# EAGLE schematic front-panel-revD-DEB-board2 (EAGLE 5.11)
DRAWN_BY: Alexios; PROJECT_NAME: CFT Mini-Computer; REVISION: Rev D; SHEET_DESCRIPTION: Output shift registers; SIMULATION_FILENAME: To be coded; URL: http://www.bedroomlan.org/cft

## Sheet 1 of 5
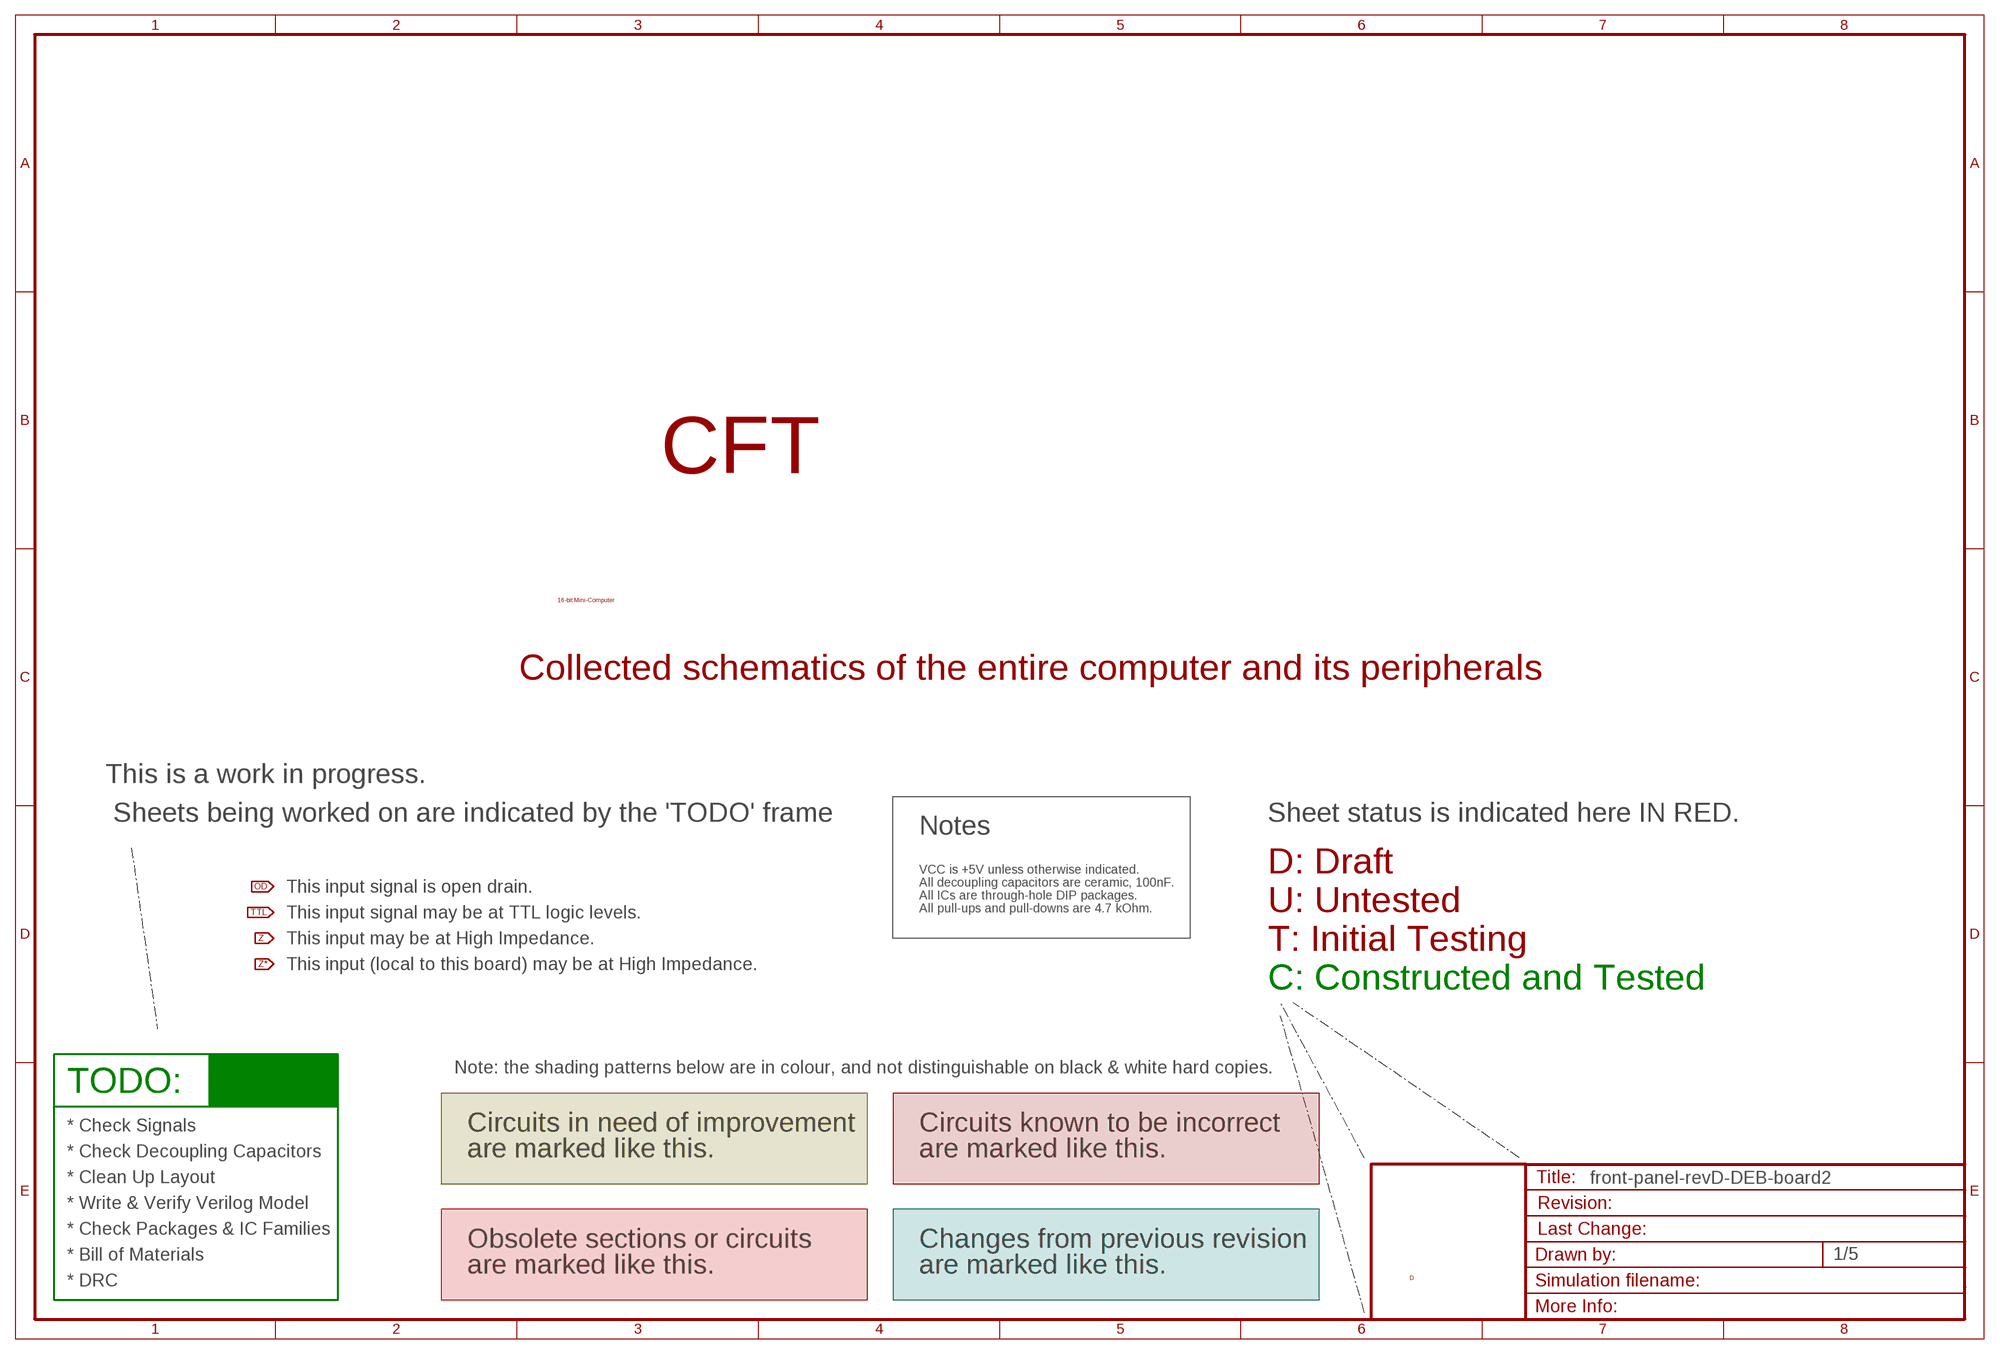
[diagram p0: schematic, sheet 1]

### Notes on the sheet
- CFT
- 16-bit Mini-Computer
- Collected schematics of the entire computer and its peripherals
- This is a work in progress.
- Sheets being worked on are indicated by the 'TODO' frame | Sheet status is indicated here IN RED.
- Notes
- VCC is +5V unless otherwise indicated. | D: Draft
- All decoupling capacitors are ceramic, 100nF.
- This input signal is open drain.
- All ICs are through-hole DIP packages.
- All pull-ups and pull-downs are 4.7 kOhm. | U: Untested
- This input signal may be at TTL logic levels.
- This input may be at High Impedance.
- T: Initial Testing
- This input (local to this board) may be at High Impedance.
- C: Constructed and Tested
- Note: the shading patterns below are in colour, and not distinguishable on black & white hard copies.
- TODO:
- * Check Signals | Circuits in need of improvement | Circuits known to be incorrect
- * Check Decoupling Capacitors | are marked like this. | are marked like this.
- * Clean Up Layout
- * Write & Verify Verilog Model
- * Check Packages & IC Families
- Obsolete sections or circuits | Changes from previous revision
- * Bill of Materials
- are marked like this. | are marked like this.
- D
- * DRC

## Sheet 2 of 5
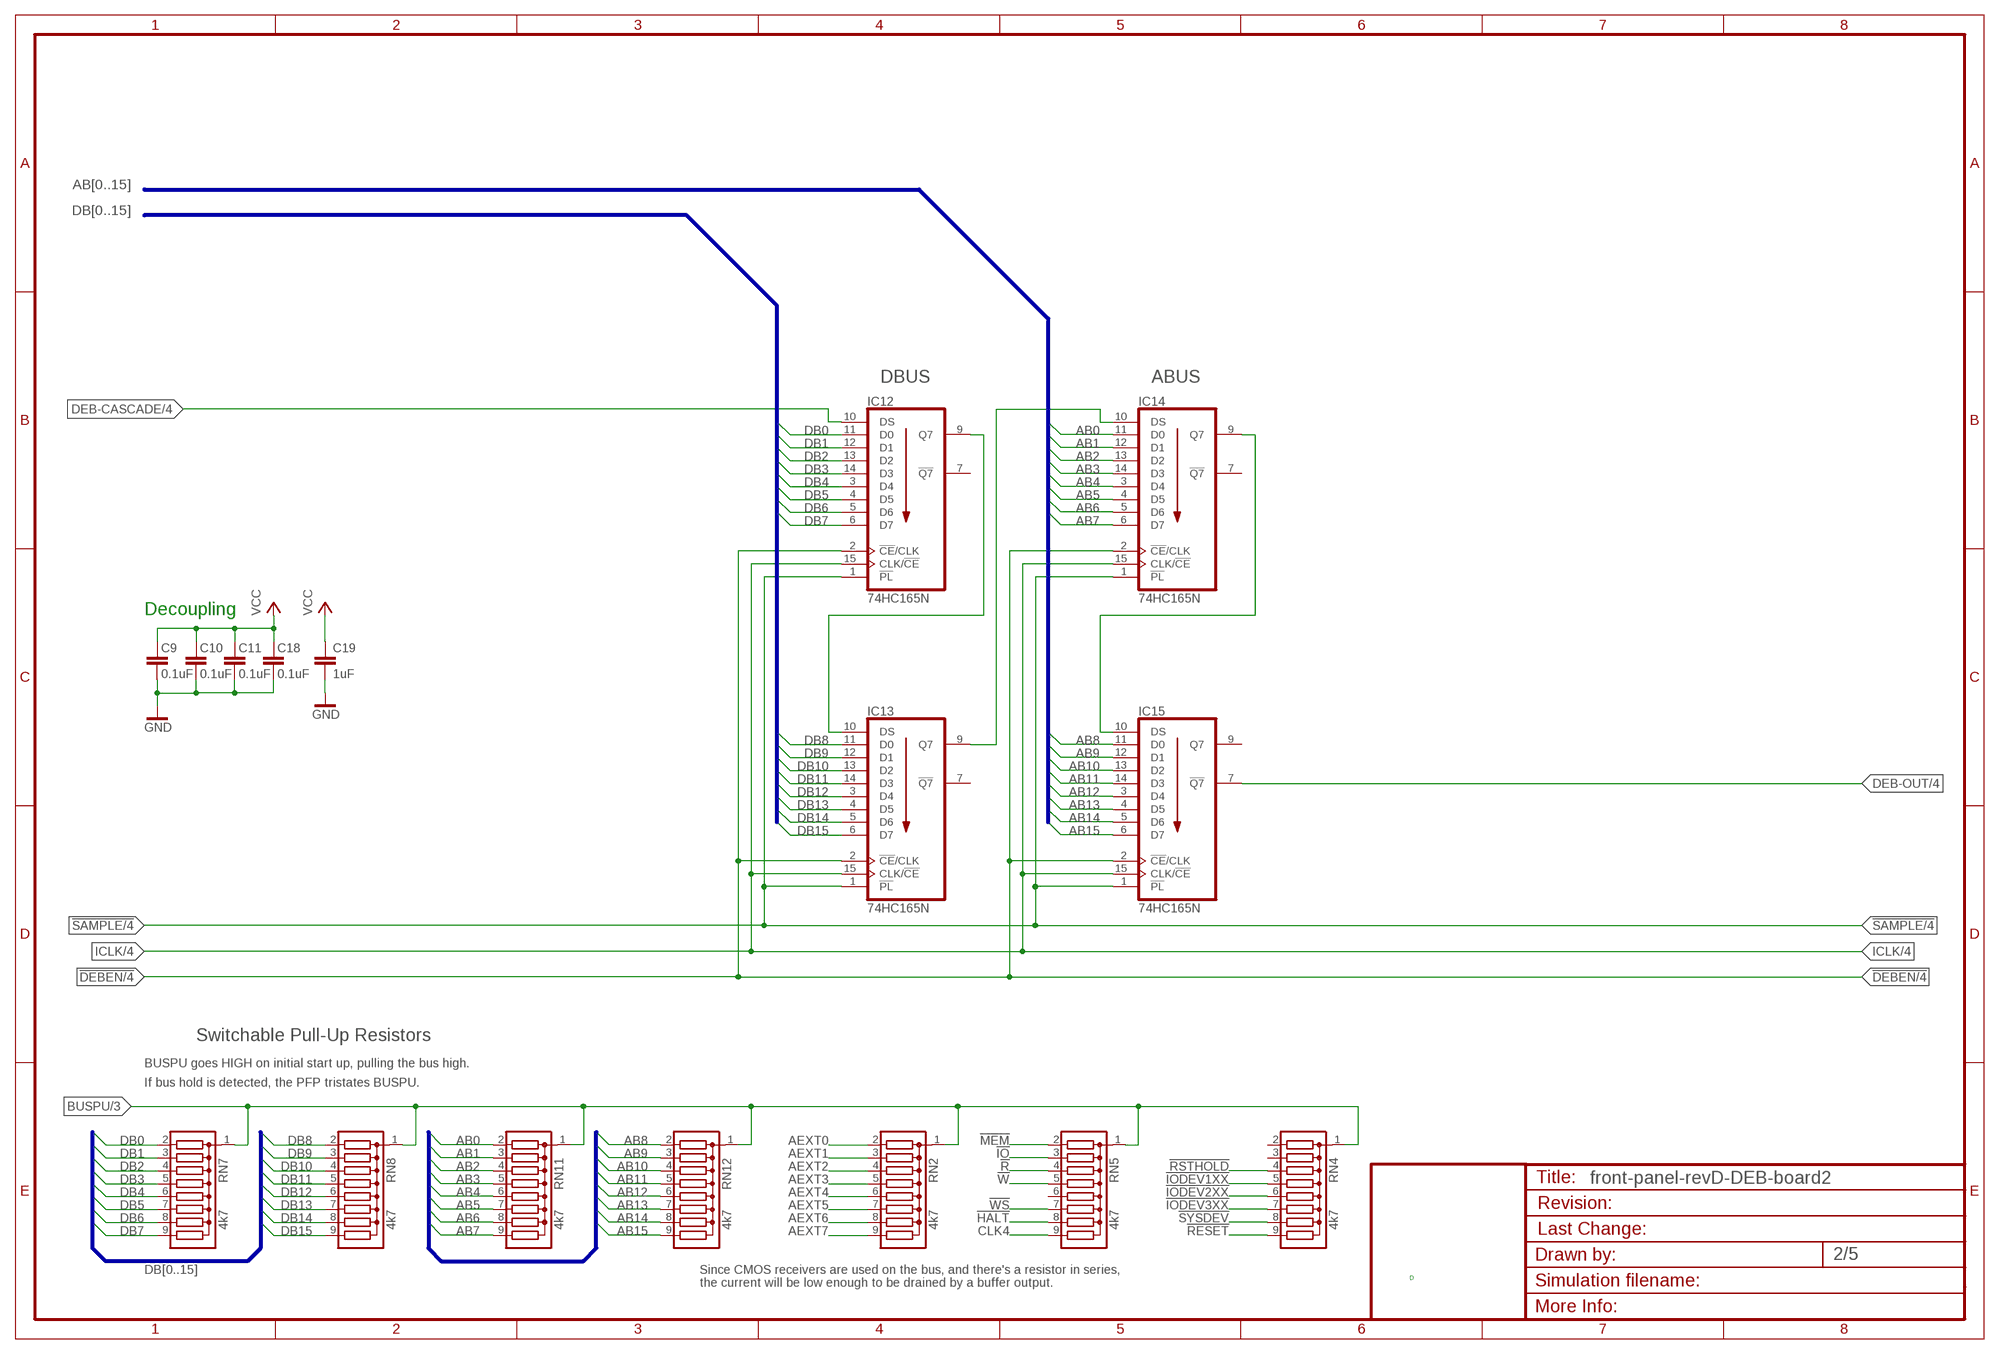
[diagram p1: schematic, sheet 2]

### Parts
C9  0.1uF  C-EU025-024X044  [C025-024X044]
C10  0.1uF  C-EU025-024X044  [C025-024X044]
C11  0.1uF  C-EU025-024X044  [C025-024X044]
C18  0.1uF  C-EU025-024X044  [C025-024X044]
C19  1uF  C-EU025-024X044  [C025-024X044]
IC12  74HC165N  [DIL16]
IC13  74HC165N  [DIL16]
IC14  74HC165N  [DIL16]
IC15  74HC165N  [DIL16]
RN2  4k7  G08R  [SIL9]
RN4  4k7  G08R  [SIL9]
RN5  4k7  G08R  [SIL9]
RN7  4k7  G08R  [SIL9]
RN8  4k7  G08R  [SIL9]
RN11  4k7  G08R  [SIL9]
RN12  4k7  G08R  [SIL9]

### Nets
!DEBEN: IC12.2(!CE!/CLK) IC13.2(!CE!/CLK) IC14.2(!CE!/CLK) IC15.2(!CE!/CLK) ; also sheet 4
!HALT: RN5.8 ; also sheet 5
!IO: RN5.3 ; also sheet 5
!IODEV1XX: RN4.5 ; also sheet 5
!IODEV2XX: RN4.6 ; also sheet 5
!IODEV3XX: RN4.7 ; also sheet 5
!MEM: RN5.2 ; also sheet 5
!R: RN5.4 ; also sheet 3,5
!RESET: RN4.9 ; also sheet 5
!RSTHOLD: RN4.4 ; also sheet 5
!SAMPLE: IC12.1(!PL) IC13.1(!PL) IC14.1(!PL) IC15.1(!PL) ; also sheet 4
!SYSDEV: RN4.8 ; also sheet 5
!W: RN5.5 ; also sheet 5
!WS: RN5.7 ; also sheet 4,5
AB0: IC14.11(D0) RN11.2 ; also sheet 3,5
AB1: IC14.12(D1) RN11.3 ; also sheet 3,5
AB2: IC14.13(D2) RN11.4 ; also sheet 3,5
AB3: IC14.14(D3) RN11.5 ; also sheet 3,5
AB4: IC14.3(D4) RN11.6 ; also sheet 3,5
AB5: IC14.4(D5) RN11.7 ; also sheet 3,5
AB6: IC14.5(D6) RN11.8 ; also sheet 3,5
AB7: IC14.6(D7) RN11.9 ; also sheet 3,5
AB8: IC15.11(D0) RN12.2 ; also sheet 3,5
AB9: IC15.12(D1) RN12.3 ; also sheet 3,5
AB10: IC15.13(D2) RN12.4 ; also sheet 3,5
AB11: IC15.14(D3) RN12.5 ; also sheet 3,5
AB12: IC15.3(D4) RN12.6 ; also sheet 3,5
AB13: IC15.4(D5) RN12.7 ; also sheet 3,5
AB14: IC15.5(D6) RN12.8 ; also sheet 3,5
AB15: IC15.6(D7) RN12.9 ; also sheet 3,5
AEXT0: RN2.2 ; also sheet 3,5
AEXT1: RN2.3 ; also sheet 3,5
AEXT2: RN2.4 ; also sheet 3,5
AEXT3: RN2.5 ; also sheet 3,5
AEXT4: RN2.6 ; also sheet 3,5
AEXT5: RN2.7 ; also sheet 3,5
AEXT6: RN2.8 ; also sheet 3,5
AEXT7: RN2.9 ; also sheet 3,5
BUSPU: RN2.1 RN4.1 RN5.1 RN7.1 RN8.1 RN11.1 RN12.1 ; also sheet 3,4
CLK4: RN5.9 ; also sheet 5
DB0: IC12.11(D0) RN7.2 ; also sheet 3,5
DB1: IC12.12(D1) RN7.3 ; also sheet 3,5
DB2: IC12.13(D2) RN7.4 ; also sheet 3,5
DB3: IC12.14(D3) RN7.5 ; also sheet 3,5
DB4: IC12.3(D4) RN7.6 ; also sheet 3,5
DB5: IC12.4(D5) RN7.7 ; also sheet 3,5
DB6: IC12.5(D6) RN7.8 ; also sheet 3,5
DB7: IC12.6(D7) RN7.9 ; also sheet 3,5
DB8: IC13.11(D0) RN8.2 ; also sheet 3,5
DB9: IC13.12(D1) RN8.3 ; also sheet 3,5
DB10: IC13.13(D2) RN8.4 ; also sheet 3,5
DB11: IC13.14(D3) RN8.5 ; also sheet 3,5
DB12: IC13.3(D4) RN8.6 ; also sheet 3,5
DB13: IC13.4(D5) RN8.7 ; also sheet 3,5
DB14: IC13.5(D6) RN8.8 ; also sheet 3,5
DB15: IC13.6(D7) RN8.9 ; also sheet 3,5
DEB-CASCADE: IC12.10(DS) ; also sheet 4
DEB-OUT: IC15.7(!Q7) ; also sheet 4
GND [low power]: C9.1 C10.1 C11.1 C18.1 C19.2 ; also sheet 3,4,5
ICLK: IC12.15(CLK/!CE!) IC13.15(CLK/!CE!) IC14.15(CLK/!CE!) IC15.15(CLK/!CE!) ; also sheet 4
N$126: IC13.9(Q7) IC14.10(DS)
N$127: IC12.9(Q7) IC13.10(DS)
N$129: IC14.9(Q7) IC15.10(DS)
VCC [low power]: C9.2 C10.2 C11.2 C18.2 C19.1 ; also sheet 3,4,5
Unconnected: IC12.7(!Q7) IC13.7(!Q7) IC14.7(!Q7) IC15.9(Q7) RN4.2 RN4.3 RN5.6

### Buses
AB[0..15]
DB[0..15]

### Notes on the sheet
- DBUS | ABUS
- Decoupling
- Switchable Pull-Up Resistors
- BUSPU goes HIGH on initial start up, pulling the bus high.
- If bus hold is detected, the PFP tristates BUSPU.
- Since CMOS receivers are used on the bus, and there's a resistor in series,
- D
- the current will be low enough to be drained by a buffer output.

## Sheet 3 of 5
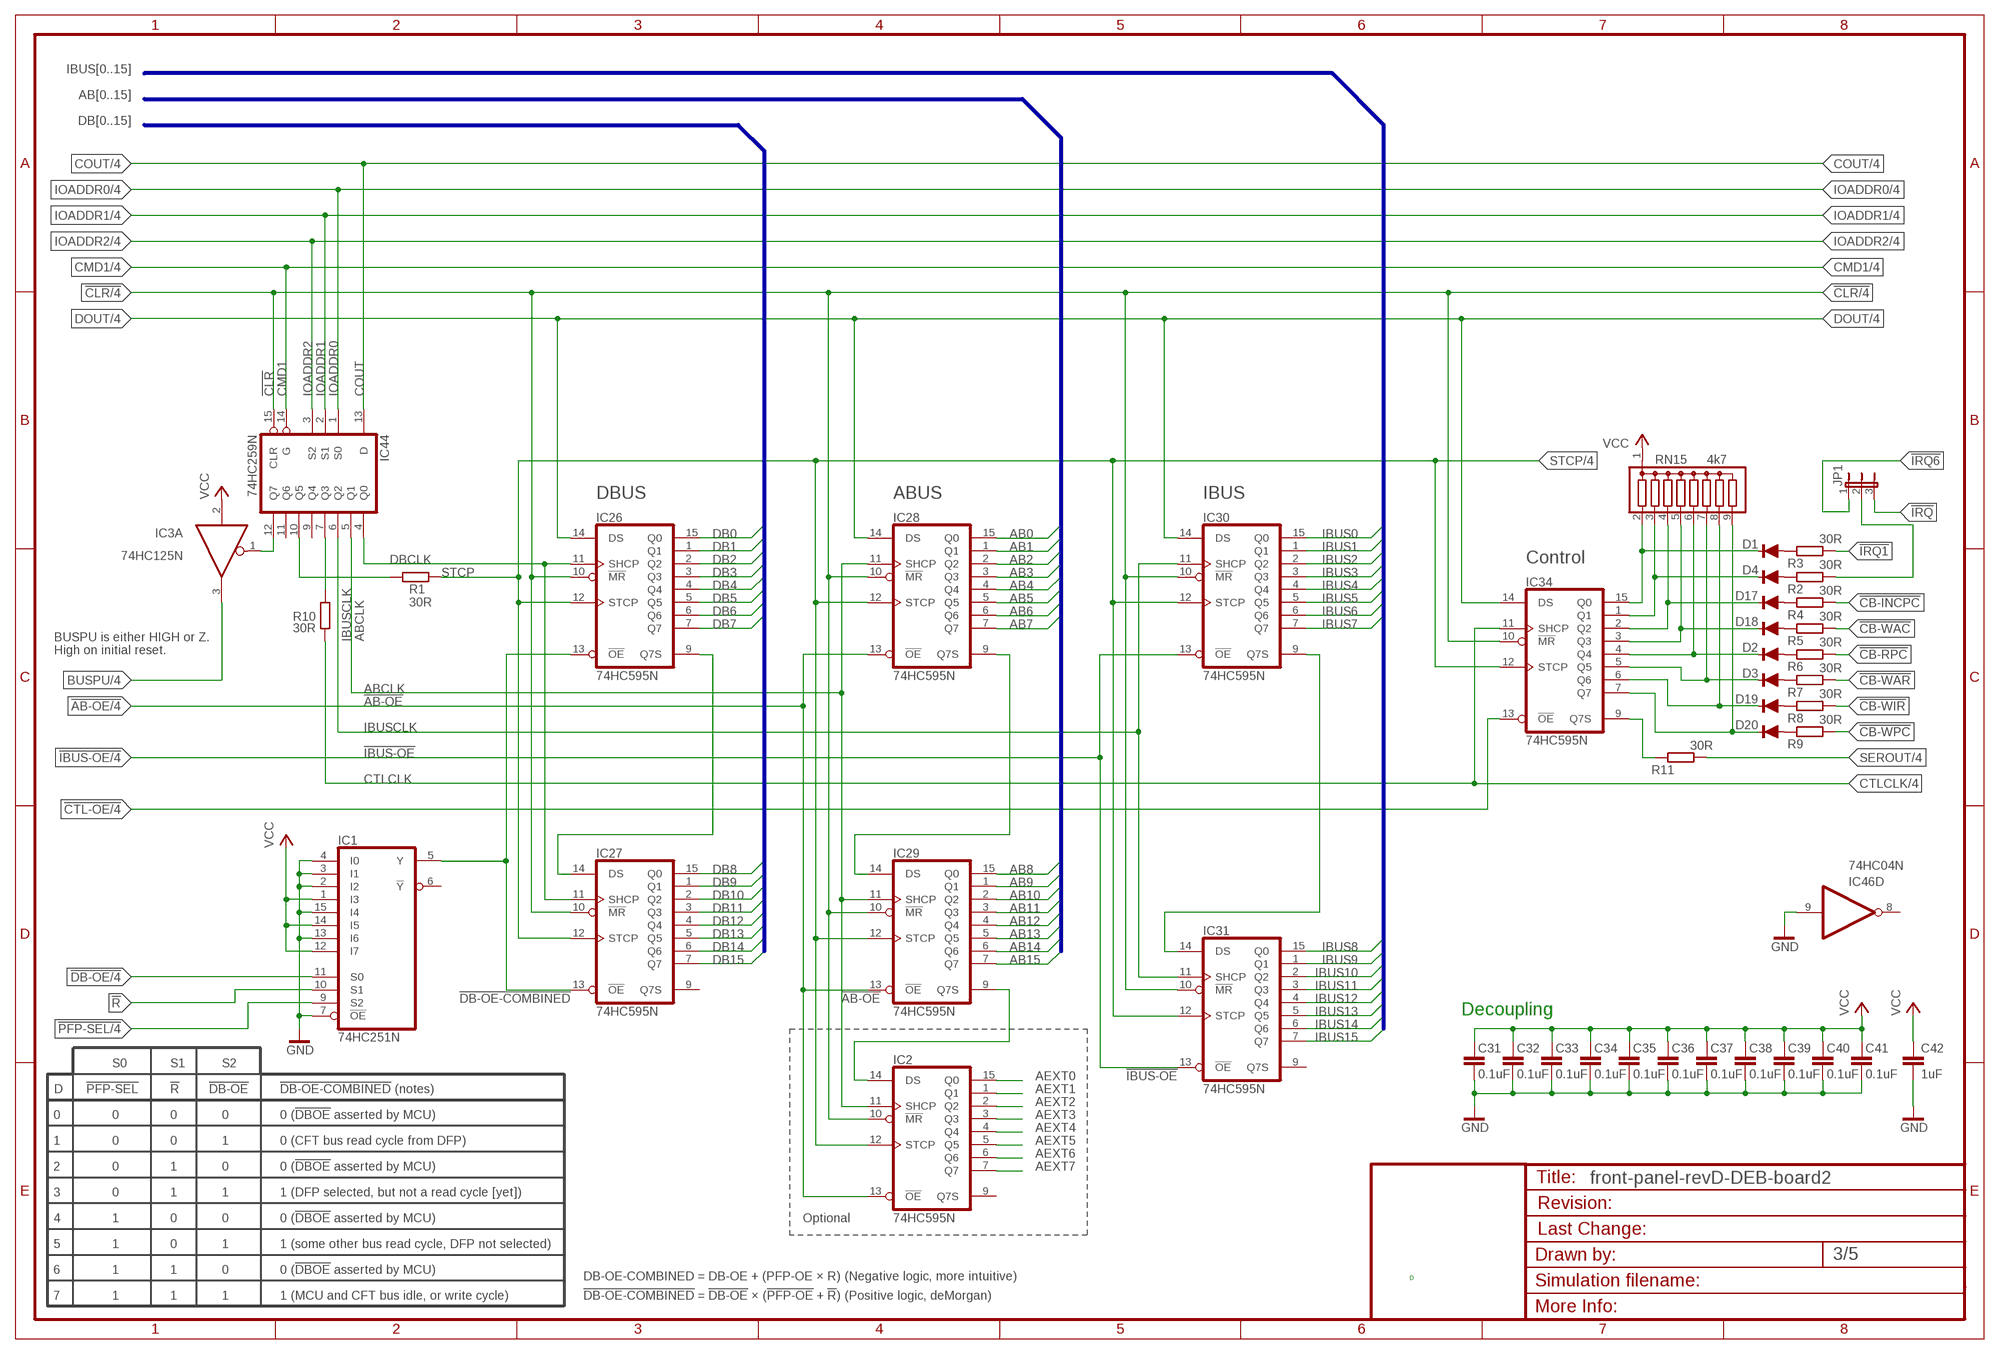
[diagram p2: schematic, sheet 3]

### Parts
C31  0.1uF  C-EU025-024X044  [C025-024X044]
C32  0.1uF  C-EU025-024X044  [C025-024X044]
C33  0.1uF  C-EU025-024X044  [C025-024X044]
C34  0.1uF  C-EU025-024X044  [C025-024X044]
C35  0.1uF  C-EU025-024X044  [C025-024X044]
C36  0.1uF  C-EU025-024X044  [C025-024X044]
C37  0.1uF  C-EU025-024X044  [C025-024X044]
C38  0.1uF  C-EU025-024X044  [C025-024X044]
C39  0.1uF  C-EU025-024X044  [C025-024X044]
C40  0.1uF  C-EU025-024X044  [C025-024X044]
C41  0.1uF  C-EU025-024X044  [C025-024X044]
C42  1uF  C-EU025-024X044  [C025-024X044]
D1  1N4148  1N4148DO35-7  [DO35-7]
D2  1N4148  1N4148DO35-7  [DO35-7]
D3  1N4148  1N4148DO35-7  [DO35-7]
D4  1N4148  1N4148DO35-7  [DO35-7]
D17  1N4148  1N4148DO35-7  [DO35-7]
D18  1N4148  1N4148DO35-7  [DO35-7]
D19  1N4148  1N4148DO35-7  [DO35-7]
D20  1N4148  1N4148DO35-7  [DO35-7]
IC1  74HC251N  [DIL16]
IC2  74HC595N  [DIL16]
IC3  74HC125N  [DIL14]
IC26  74HC595N  [DIL16]
IC27  74HC595N  [DIL16]
IC28  74HC595N  [DIL16]
IC29  74HC595N  [DIL16]
IC30  74HC595N  [DIL16]
IC31  74HC595N  [DIL16]
IC34  74HC595N  [DIL16]
IC44  74HC259N  [DIL16]
IC46  74HC04N  [DIL14]
JP1  JP2E  [JP2]
R1  30R  R-EU_0204/7  [0204/7]
R2  30R  R-EU_0204/7  [0204/7]
R3  30R  R-EU_0204/7  [0204/7]
R4  30R  R-EU_0204/7  [0204/7]
R5  30R  R-EU_0204/7  [0204/7]
R6  30R  R-EU_0204/7  [0204/7]
R7  30R  R-EU_0204/7  [0204/7]
R8  30R  R-EU_0204/7  [0204/7]
R9  30R  R-EU_0204/7  [0204/7]
R10  30R  R-EU_0204/7  [0204/7]
R11  30R  R-EU_0204/7  [0204/7]
RN15  4k7  G08R  [SIL9]

### Nets
!AB-OE: IC2.13(!OE) IC28.13(!OE) IC29.13(!OE) ; also sheet 4
!CB-INCPC: R4.1 ; also sheet 5
!CB-RPC: R6.1 ; also sheet 5
!CB-WAC: R5.1 ; also sheet 5
!CB-WAR: R7.1 ; also sheet 5
!CB-WIR: R8.1 ; also sheet 5
!CB-WPC: R9.1 ; also sheet 5
!CLR: IC2.10(!MR) IC26.10(!MR) IC27.10(!MR) IC28.10(!MR) IC29.10(!MR) IC30.10(!MR) IC31.10(!MR) IC34.10(!MR) IC44.15(CLR) ; also sheet 4
!CTL-OE: IC34.13(!OE) ; also sheet 4
!DB-OE: IC1.11(S0) ; also sheet 4
!DB-OE-COMBINED: IC1.5(Y) IC26.13(!OE) IC27.13(!OE)
!IBUS-OE: IC30.13(!OE) IC31.13(!OE) ; also sheet 4
!IRQ: JP1.3 ; also sheet 5
!IRQ1: R3.1 ; also sheet 5
!IRQ6: JP1.1 ; also sheet 5
!PFP-SEL: IC1.9(S2) ; also sheet 4
!R: IC1.10(S1) ; also sheet 2,5
AB0: IC28.15(Q0) ; also sheet 2,5
AB1: IC28.1(Q1) ; also sheet 2,5
AB2: IC28.2(Q2) ; also sheet 2,5
AB3: IC28.3(Q3) ; also sheet 2,5
AB4: IC28.4(Q4) ; also sheet 2,5
AB5: IC28.5(Q5) ; also sheet 2,5
AB6: IC28.6(Q6) ; also sheet 2,5
AB7: IC28.7(Q7) ; also sheet 2,5
AB8: IC29.15(Q0) ; also sheet 2,5
AB9: IC29.1(Q1) ; also sheet 2,5
AB10: IC29.2(Q2) ; also sheet 2,5
AB11: IC29.3(Q3) ; also sheet 2,5
AB12: IC29.4(Q4) ; also sheet 2,5
AB13: IC29.5(Q5) ; also sheet 2,5
AB14: IC29.6(Q6) ; also sheet 2,5
AB15: IC29.7(Q7) ; also sheet 2,5
ABCLK: IC2.11(SHCP) IC28.11(SHCP) IC29.11(SHCP) IC44.5(Q1)
AEXT0: IC2.15(Q0) ; also sheet 2,5
AEXT1: IC2.1(Q1) ; also sheet 2,5
AEXT2: IC2.2(Q2) ; also sheet 2,5
AEXT3: IC2.3(Q3) ; also sheet 2,5
AEXT4: IC2.4(Q4) ; also sheet 2,5
AEXT5: IC2.5(Q5) ; also sheet 2,5
AEXT6: IC2.6(Q6) ; also sheet 2,5
AEXT7: IC2.7(Q7) ; also sheet 2,5
BUSPU: IC3.3(A:O) ; also sheet 2,4
CMD1: IC44.14(G) ; also sheet 4
COUT: IC44.13(D) ; also sheet 4
CTLCLK: IC34.11(SHCP) R10.2 ; also sheet 4
DB0: IC26.15(Q0) ; also sheet 2,5
DB1: IC26.1(Q1) ; also sheet 2,5
DB2: IC26.2(Q2) ; also sheet 2,5
DB3: IC26.3(Q3) ; also sheet 2,5
DB4: IC26.4(Q4) ; also sheet 2,5
DB5: IC26.5(Q5) ; also sheet 2,5
DB6: IC26.6(Q6) ; also sheet 2,5
DB7: IC26.7(Q7) ; also sheet 2,5
DB8: IC27.15(Q0) ; also sheet 2,5
DB9: IC27.1(Q1) ; also sheet 2,5
DB10: IC27.2(Q2) ; also sheet 2,5
DB11: IC27.3(Q3) ; also sheet 2,5
DB12: IC27.4(Q4) ; also sheet 2,5
DB13: IC27.5(Q5) ; also sheet 2,5
DB14: IC27.6(Q6) ; also sheet 2,5
DB15: IC27.7(Q7) ; also sheet 2,5
DBCLK: IC26.11(SHCP) IC27.11(SHCP) IC44.4(Q0)
DOUT: IC26.14(DS) IC28.14(DS) IC30.14(DS) IC34.14(DS) ; also sheet 4
GND [low power]: C31.1 C32.1 C33.1 C34.1 C35.1 C36.1 C37.1 C38.1 C39.1 C40.1 C41.1 C42.2 IC1.2(I2) IC1.3(I1) IC1.4(I0) IC1.7(!OE) IC1.13(I6) IC1.15(I4) IC46.9(D:I) ; also sheet 2,4,5
IBUS0: IC30.15(Q0) ; also sheet 5
IBUS1: IC30.1(Q1) ; also sheet 5
IBUS2: IC30.2(Q2) ; also sheet 5
IBUS3: IC30.3(Q3) ; also sheet 5
IBUS4: IC30.4(Q4) ; also sheet 5
IBUS5: IC30.5(Q5) ; also sheet 5
IBUS6: IC30.6(Q6) ; also sheet 5
IBUS7: IC30.7(Q7) ; also sheet 5
IBUS8: IC31.15(Q0) ; also sheet 5
IBUS9: IC31.1(Q1) ; also sheet 5
IBUS10: IC31.2(Q2) ; also sheet 5
IBUS11: IC31.3(Q3) ; also sheet 5
IBUS12: IC31.4(Q4) ; also sheet 5
IBUS13: IC31.5(Q5) ; also sheet 5
IBUS14: IC31.6(Q6) ; also sheet 5
IBUS15: IC31.7(Q7) ; also sheet 5
IBUSCLK: IC30.11(SHCP) IC31.11(SHCP) IC44.6(Q2)
IOADDR0: IC44.1(S0) ; also sheet 4
IOADDR1: IC44.2(S1) ; also sheet 4
IOADDR2: IC44.3(S2) ; also sheet 4
N$1: D1.C IC34.15(Q0) RN15.2
N$2: D2.C IC34.4(Q4) RN15.6
N$3: D3.C IC34.5(Q5) RN15.7
N$4: D4.C IC34.1(Q1) RN15.3
N$5: D4.A R2.2
N$6: D1.A R3.2
N$7: D17.A R4.2
N$8: D18.A R5.2
N$9: D2.A R6.2
N$10: D3.A R7.2
N$11: D19.A R8.2
N$12: D20.A R9.2
N$13: IC44.7(Q3) R10.1
N$14: IC34.9(Q7S) R11.2
N$15: JP1.2 R2.1
N$16: IC3.1(A:OE) IC44.12(Q7)
N$18: IC44.10(Q5) R1.1
N$19: IC2.14(DS) IC29.9(Q7S)
N$111: IC26.9(Q7S) IC27.14(DS)
N$112: IC28.9(Q7S) IC29.14(DS)
N$113: IC30.9(Q7S) IC31.14(DS)
N$155: D17.C IC34.2(Q2) RN15.4
N$157: D18.C IC34.3(Q3) RN15.5
N$160: D19.C IC34.6(Q6) RN15.8
N$161: D20.C IC34.7(Q7) RN15.9
SEROUT: R11.1 ; also sheet 4
STCP: IC2.12(STCP) IC26.12(STCP) IC27.12(STCP) IC28.12(STCP) IC29.12(STCP) IC30.12(STCP) IC31.12(STCP) IC34.12(STCP) R1.2 ; also sheet 4
VCC [low power]: C31.2 C32.2 C33.2 C34.2 C35.2 C36.2 C37.2 C38.2 C39.2 C40.2 C41.2 C42.1 IC1.1(I3) IC1.12(I7) IC1.14(I5) IC3.2(A:I) RN15.1 ; also sheet 2,4,5
Unconnected: IC1.6(!Y) IC2.9(Q7S) IC3.4(B:OE) IC3.5(B:I) IC3.6(B:O) IC3.8(C:O) IC3.9(C:I) IC3.10(C:OE) IC3.11(D:O) IC3.12(D:I) IC3.13(D:OE) IC27.9(Q7S) IC31.9(Q7S) IC44.9(Q4) IC44.11(Q6) IC46.8(D:O)

### Buses
DB[0..15]
AB[0..15]
IBUS[0..15]

### Notes on the sheet
- DBUS | ABUS | IBUS
- Control
- BUSPU is either HIGH or Z.
- High on initial reset.
- Decoupling
- S0 | S1 | S2
- D | !PFP-SEL | !R | !DB-OE | !DB-OE-COMBINED! (notes)
- 0 | 0 | 0 | 0 | 0 (!DBOE! asserted by MCU)
- 1 | 0 | 0 | 1 | 0 (CFT bus read cycle from DFP)
- 2 | 0 | 1 | 0 | 0 (!DBOE! asserted by MCU)
- 3 | 0 | 1 | 1 | 1 (DFP selected, but not a read cycle [yet])
- 4 | 1 | 0 | 0 | 0 (!DBOE! asserted by MCU) | Optional
- 5 | 1 | 0 | 1 | 1 (some other bus read cycle, DFP not selected)
- 6 | 1 | 1 | 0 | 0 (!DBOE! asserted by MCU)
- DB-OE-COMBINED = DB-OE + (PFP-OE × R) (Negative logic, more intuitive) | D
- 7 | 1 | 1 | 1 | 1 (MCU and CFT bus idle, or write cycle) | !DB-OE-COMBINED! = !DB-OE! × (!PFP-OE! + !R!) (Positive logic, deMorgan)

## Sheet 4 of 5
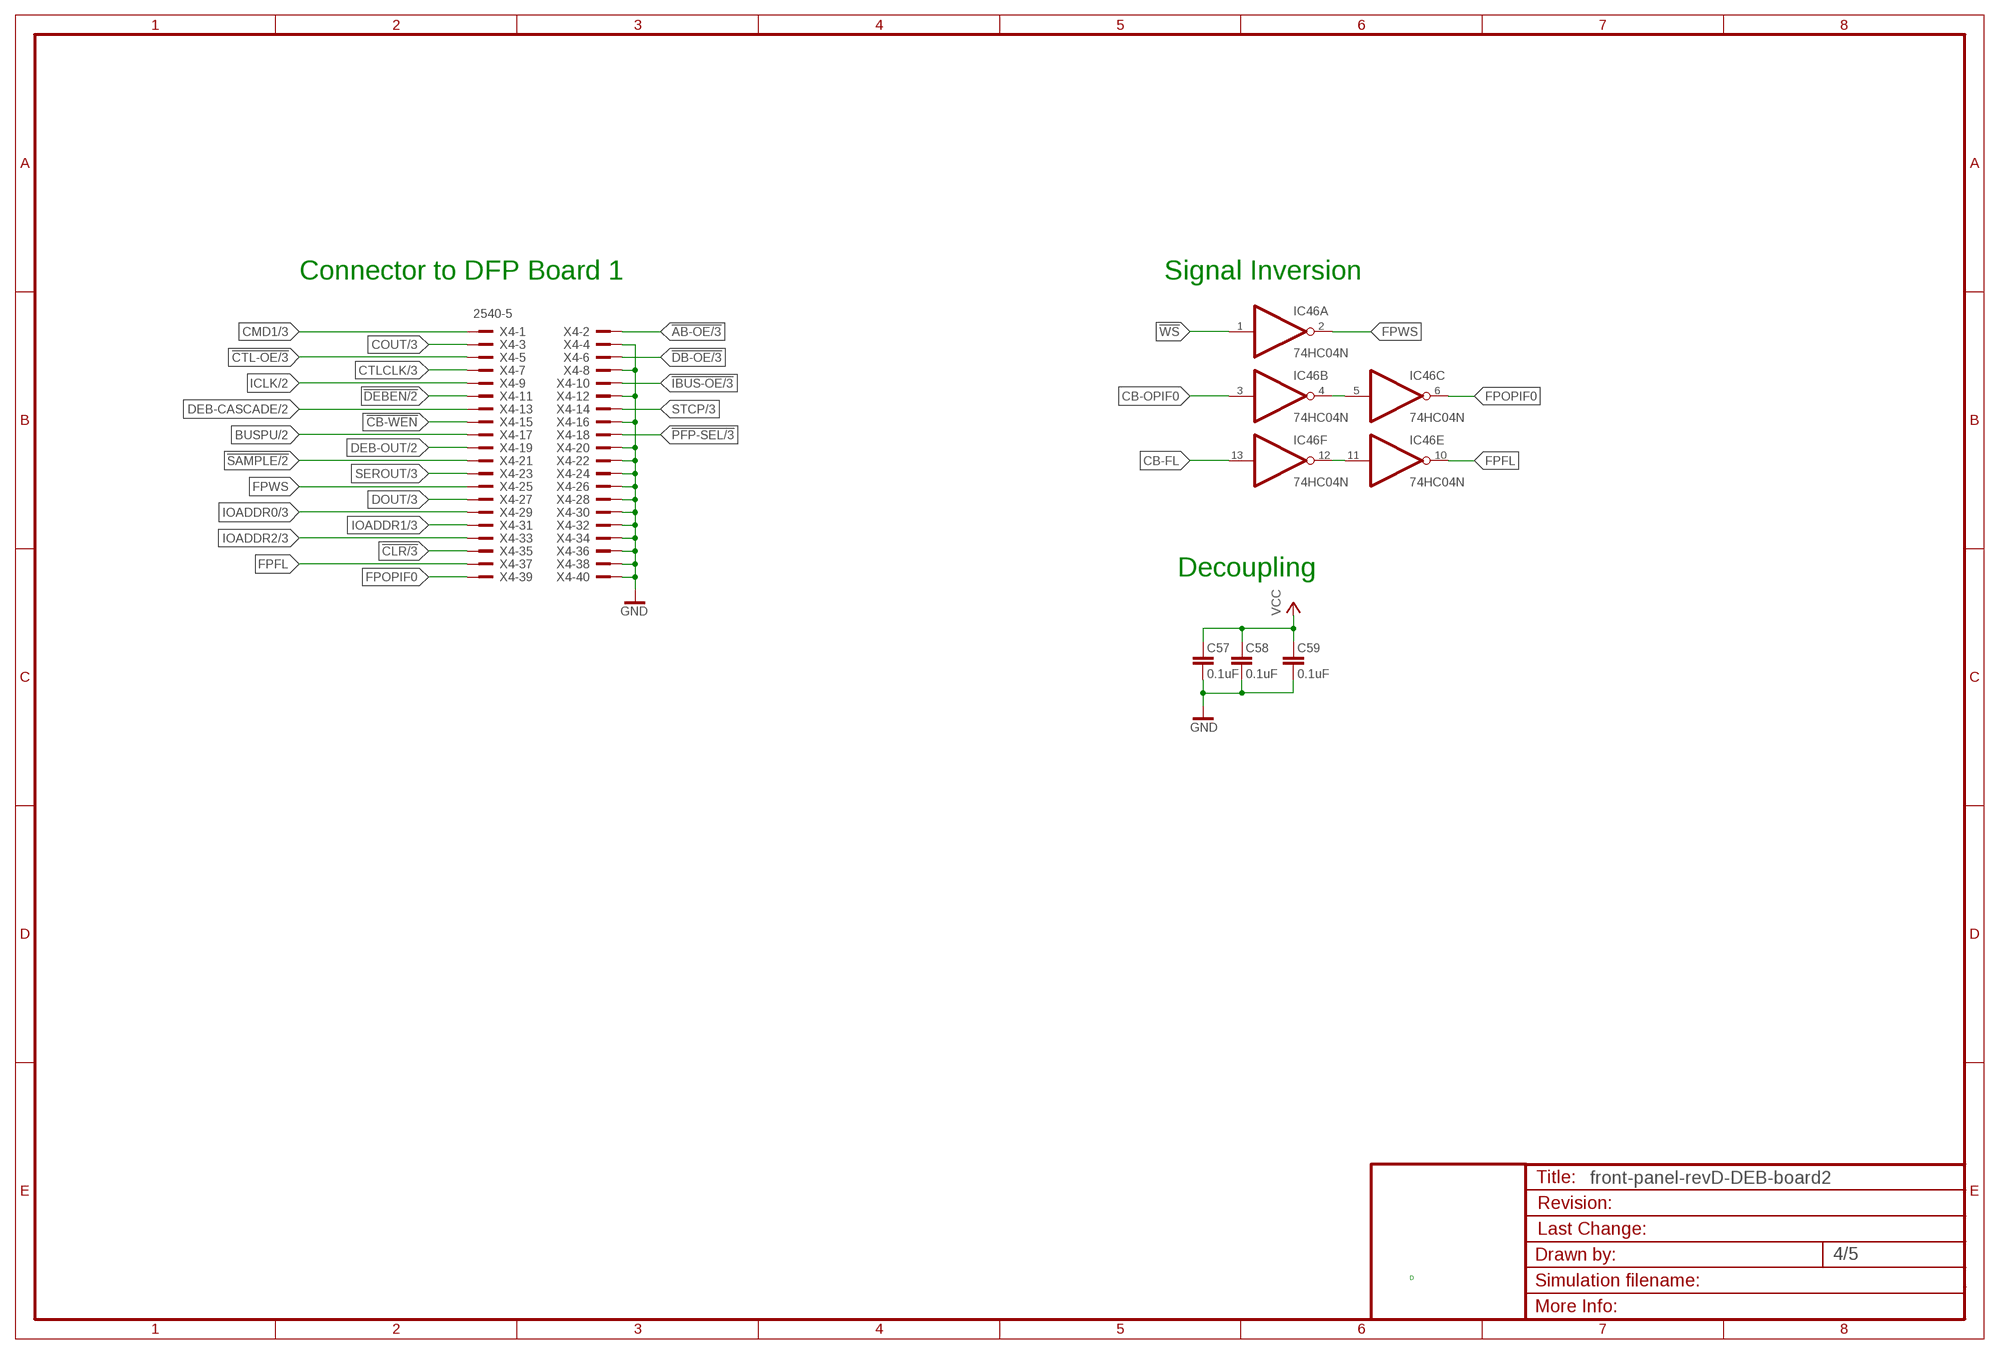
[diagram p3: schematic, sheet 4]

### Parts
C57  0.1uF  C-EU025-024X044  [C025-024X044]
C58  0.1uF  C-EU025-024X044  [C025-024X044]
C59  0.1uF  C-EU025-024X044  [C025-024X044]
X4  2540-5  [PAK100/2500-5-40]

### Nets
!AB-OE: X4.2 ; also sheet 3
!CB-WEN: X4.15 ; also sheet 5
!CLR: X4.35 ; also sheet 3
!CTL-OE: X4.5 ; also sheet 3
!DB-OE: X4.6 ; also sheet 3
!DEBEN: X4.11 ; also sheet 2
!IBUS-OE: X4.10 ; also sheet 3
!PFP-SEL: X4.18 ; also sheet 3
!SAMPLE: X4.21 ; also sheet 2
!WS: IC46.1(A:I) ; also sheet 2,5
BUSPU: X4.17 ; also sheet 2,3
CB-FL: IC46.13(F:I) ; also sheet 5
CB-OPIF0: IC46.3(B:I) ; also sheet 5
CMD1: X4.1 ; also sheet 3
COUT: X4.3 ; also sheet 3
CTLCLK: X4.7 ; also sheet 3
DEB-CASCADE: X4.13 ; also sheet 2
DEB-OUT: X4.19 ; also sheet 2
DOUT: X4.27 ; also sheet 3
FPFL: IC46.10(E:O) X4.37
FPOPIF0: IC46.6(C:O) X4.39
FPWS: IC46.2(A:O) X4.25
GND [low power]: C57.1 C58.1 C59.1 X4.4 X4.8 X4.12 X4.16 X4.20 X4.22 X4.24 X4.26 X4.28 X4.30 X4.32 X4.34 X4.36 X4.38 X4.40 ; also sheet 2,3,5
ICLK: X4.9 ; also sheet 2
IOADDR0: X4.29 ; also sheet 3
IOADDR1: X4.31 ; also sheet 3
IOADDR2: X4.33 ; also sheet 3
N$38: IC46.11(E:I) IC46.12(F:O)
N$43: IC46.4(B:O) IC46.5(C:I)
SEROUT: X4.23 ; also sheet 3
STCP: X4.14 ; also sheet 3
VCC [low power]: C57.2 C58.2 C59.2 ; also sheet 2,3,5

### Notes on the sheet
- Connector to DFP Board 1 | Signal Inversion
- Decoupling
- D

## Sheet 5 of 5
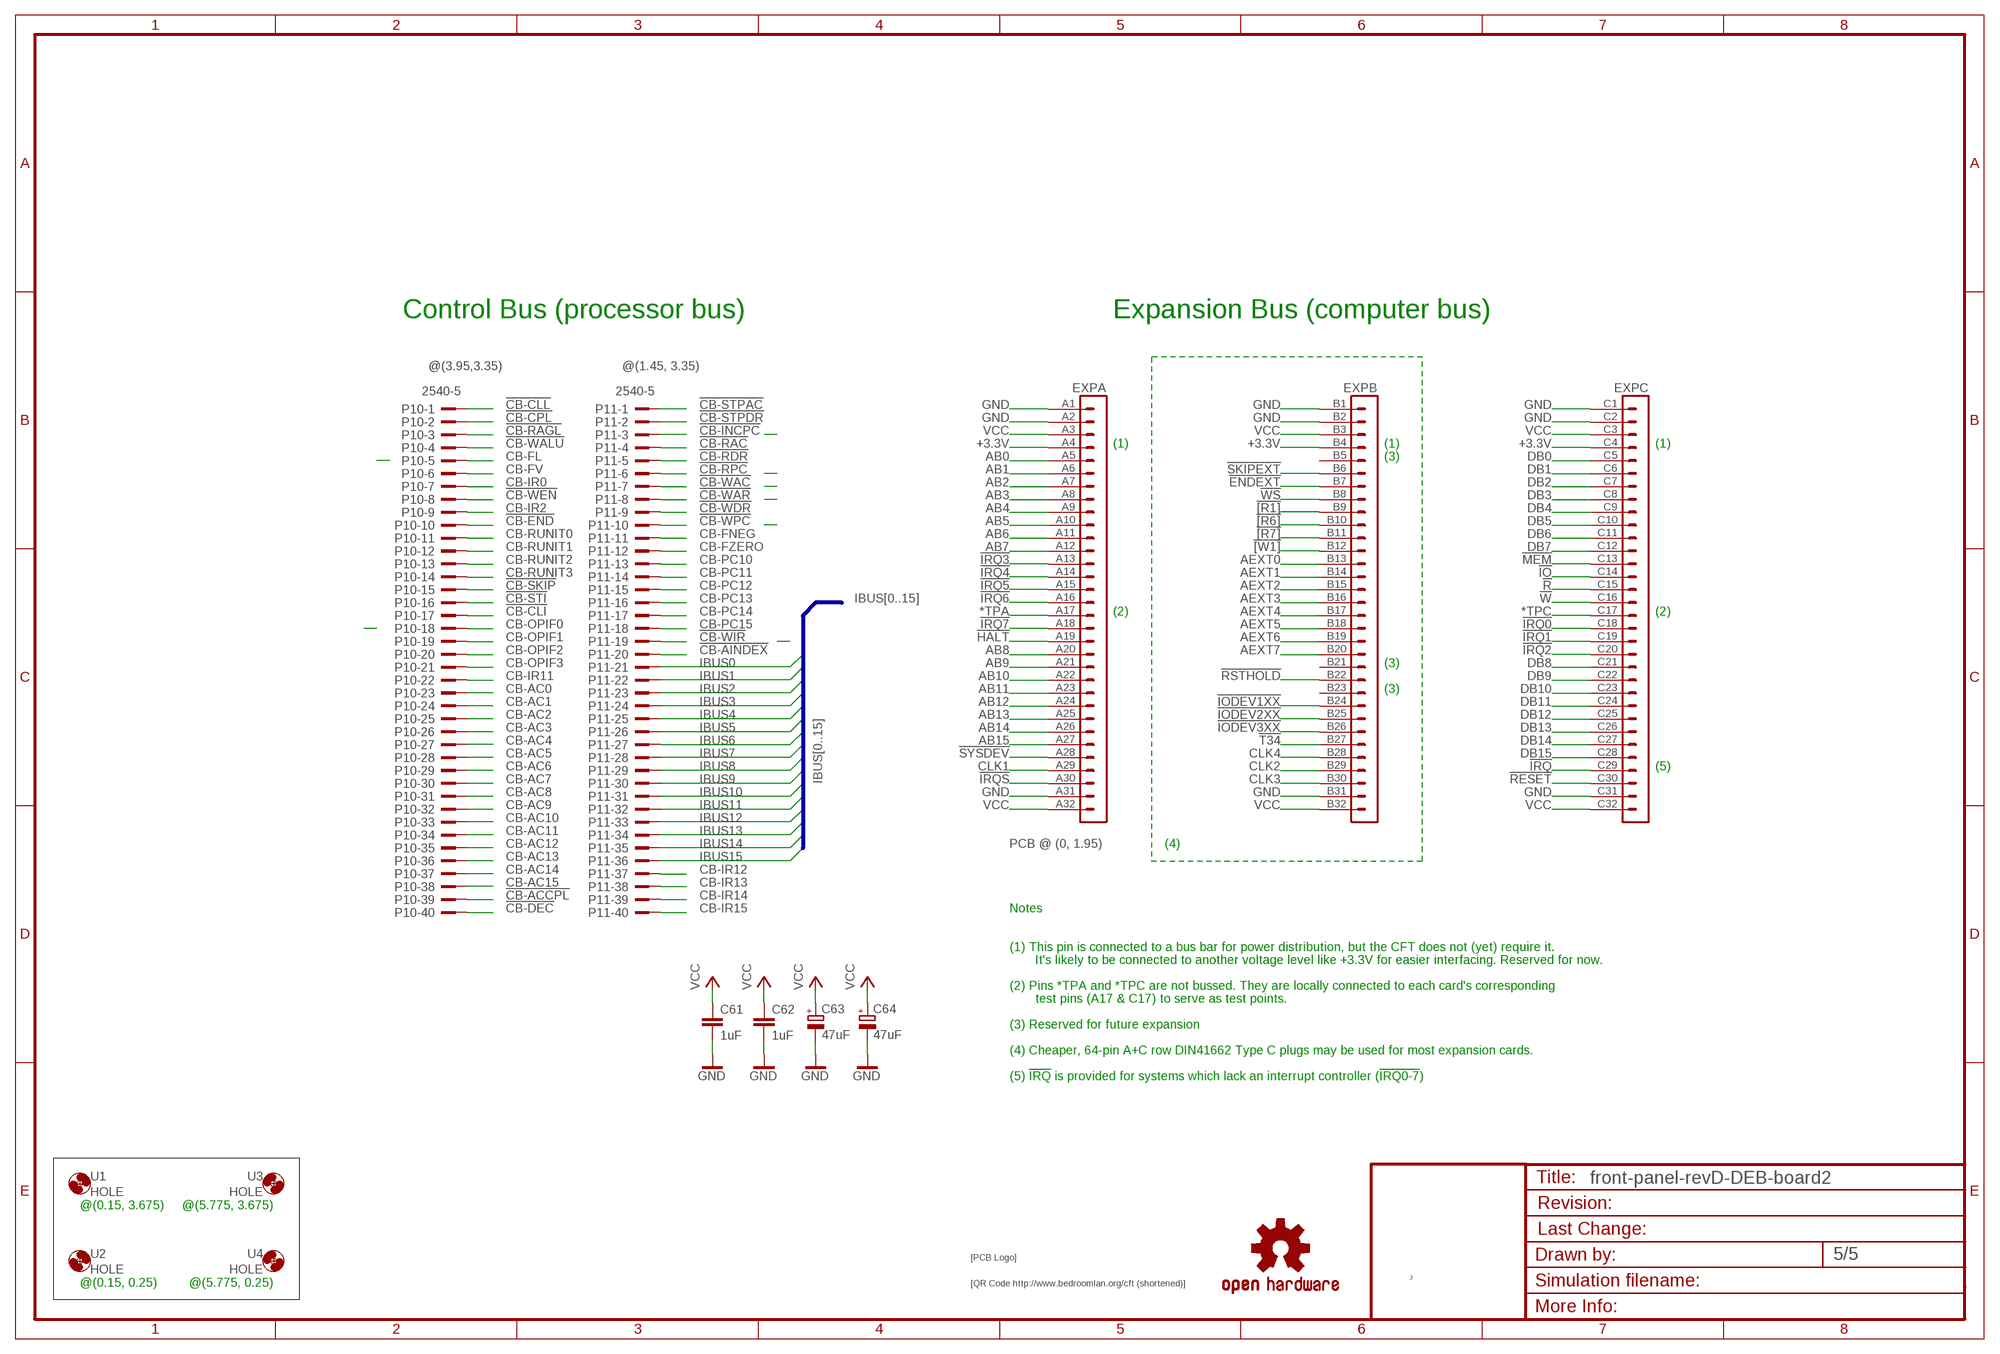
[diagram p4: schematic, sheet 5]

### Parts
$4_37_$  SIGNATURESILK  [SIGNATURE]
$4_39_$  OSHW-LOGOL  [OSHW-LOGO-L]
$4_40_$  QRCODE-CFT  [CFT-QRCODE]
C61  1uF  C-EUC0805K  [C0805K]
C62  1uF  C-EUC0805K  [C0805K]
C63  47uF  CPOL-EUE2.5-5  [E2,5-5]
C64  47uF  CPOL-EUE2.5-5  [E2,5-5]
EXP  VG96-3K  [VG96K]
P10  2540-5  [PAK100/2500-5-40]
P11  2540-5  [PAK100/2500-5-40]
U1  HOLE  [STANDOFF_28_60]
U2  HOLE  [STANDOFF_28_60]
U3  HOLE  [STANDOFF_28_60]
U4  HOLE  [STANDOFF_28_60]

### Nets
![R1]: EXP.B9
![R6]: EXP.B10
![R7]: EXP.B11
![W1]: EXP.B12
!CB-ACCPL: P10.39
!CB-AINDEX: P11.20
!CB-CLI: P10.17
!CB-CLL: P10.1
!CB-CPL: P10.2
!CB-DEC: P10.40
!CB-END: P10.10
!CB-INCPC: P11.3 ; also sheet 3
!CB-RAC: P11.4
!CB-RAGL: P10.3
!CB-RDR: P11.5
!CB-RPC: P11.6 ; also sheet 3
!CB-SKIP: P10.15
!CB-STI: P10.16
!CB-STPAC: P11.1
!CB-STPDR: P11.2
!CB-WAC: P11.7 ; also sheet 3
!CB-WALU: P10.4
!CB-WAR: P11.8 ; also sheet 3
!CB-WDR: P11.9
!CB-WEN: P10.8 ; also sheet 4
!CB-WIR: P11.19 ; also sheet 3
!CB-WPC: P11.10 ; also sheet 3
!ENDEXT: EXP.B7
!HALT: EXP.A19 ; also sheet 2
!IO: EXP.C14 ; also sheet 2
!IODEV1XX: EXP.B24 ; also sheet 2
!IODEV2XX: EXP.B25 ; also sheet 2
!IODEV3XX: EXP.B26 ; also sheet 2
!IRQ: EXP.C29 ; also sheet 3
!IRQ0: EXP.C18
!IRQ1: EXP.C19 ; also sheet 3
!IRQ2: EXP.C20
!IRQ3: EXP.A13
!IRQ4: EXP.A14
!IRQ5: EXP.A15
!IRQ6: EXP.A16 ; also sheet 3
!IRQ7: EXP.A18
!IRQS: EXP.A30
!MEM: EXP.C13 ; also sheet 2
!R: EXP.C15 ; also sheet 2,3
!RESET: EXP.C30 ; also sheet 2
!RSTHOLD: EXP.B22 ; also sheet 2
!SKIPEXT: EXP.B6
!SYSDEV: EXP.A28 ; also sheet 2
!T34: EXP.B27
!W: EXP.C16 ; also sheet 2
!WS: EXP.B8 ; also sheet 2,4
*TPA: EXP.A17
*TPC: EXP.C17
+3.3V [Power Rail]: EXP.A4 EXP.B4 EXP.C4
AB0: EXP.A5 ; also sheet 2,3
AB1: EXP.A6 ; also sheet 2,3
AB2: EXP.A7 ; also sheet 2,3
AB3: EXP.A8 ; also sheet 2,3
AB4: EXP.A9 ; also sheet 2,3
AB5: EXP.A10 ; also sheet 2,3
AB6: EXP.A11 ; also sheet 2,3
AB7: EXP.A12 ; also sheet 2,3
AB8: EXP.A20 ; also sheet 2,3
AB9: EXP.A21 ; also sheet 2,3
AB10: EXP.A22 ; also sheet 2,3
AB11: EXP.A23 ; also sheet 2,3
AB12: EXP.A24 ; also sheet 2,3
AB13: EXP.A25 ; also sheet 2,3
AB14: EXP.A26 ; also sheet 2,3
AB15: EXP.A27 ; also sheet 2,3
AEXT0: EXP.B13 ; also sheet 2,3
AEXT1: EXP.B14 ; also sheet 2,3
AEXT2: EXP.B15 ; also sheet 2,3
AEXT3: EXP.B16 ; also sheet 2,3
AEXT4: EXP.B17 ; also sheet 2,3
AEXT5: EXP.B18 ; also sheet 2,3
AEXT6: EXP.B19 ; also sheet 2,3
AEXT7: EXP.B20 ; also sheet 2,3
CB-AC0: P10.23
CB-AC1: P10.24
CB-AC2: P10.25
CB-AC3: P10.26
CB-AC4: P10.27
CB-AC5: P10.28
CB-AC6: P10.29
CB-AC7: P10.30
CB-AC8: P10.31
CB-AC9: P10.32
CB-AC10: P10.33
CB-AC11: P10.34
CB-AC12: P10.35
CB-AC13: P10.36
CB-AC14: P10.37
CB-AC15: P10.38
CB-FL: P10.5 ; also sheet 4
CB-FNEG: P11.11
CB-FV: P10.6
CB-FZERO: P11.12
CB-IR0: P10.7
CB-IR2: P10.9
CB-IR11: P10.22
CB-IR12: P11.37
CB-IR13: P11.38
CB-IR14: P11.39
CB-IR15: P11.40
CB-OPIF0: P10.18 ; also sheet 4
CB-OPIF1: P10.19
CB-OPIF2: P10.20
CB-OPIF3: P10.21
CB-PC10: P11.13
CB-PC11: P11.14
CB-PC12: P11.15
CB-PC13: P11.16
CB-PC14: P11.17
CB-PC15: P11.18
CB-RUNIT0: P10.11
CB-RUNIT1: P10.12
CB-RUNIT2: P10.13
CB-RUNIT3: P10.14
CLK1: EXP.A29
CLK2: EXP.B29
CLK3: EXP.B30
CLK4: EXP.B28 ; also sheet 2
DB0: EXP.C5 ; also sheet 2,3
DB1: EXP.C6 ; also sheet 2,3
DB2: EXP.C7 ; also sheet 2,3
DB3: EXP.C8 ; also sheet 2,3
DB4: EXP.C9 ; also sheet 2,3
DB5: EXP.C10 ; also sheet 2,3
DB6: EXP.C11 ; also sheet 2,3
DB7: EXP.C12 ; also sheet 2,3
DB8: EXP.C21 ; also sheet 2,3
DB9: EXP.C22 ; also sheet 2,3
DB10: EXP.C23 ; also sheet 2,3
DB11: EXP.C24 ; also sheet 2,3
DB12: EXP.C25 ; also sheet 2,3
DB13: EXP.C26 ; also sheet 2,3
DB14: EXP.C27 ; also sheet 2,3
DB15: EXP.C28 ; also sheet 2,3
GND [low power]: C61.2 C62.2 C63.- C64.- EXP.A1 EXP.A2 EXP.A31 EXP.B1 EXP.B2 EXP.B31 EXP.C1 EXP.C2 EXP.C31 ; also sheet 2,3,4
IBUS0: P11.21 ; also sheet 3
IBUS1: P11.22 ; also sheet 3
IBUS2: P11.23 ; also sheet 3
IBUS3: P11.24 ; also sheet 3
IBUS4: P11.25 ; also sheet 3
IBUS5: P11.26 ; also sheet 3
IBUS6: P11.27 ; also sheet 3
IBUS7: P11.28 ; also sheet 3
IBUS8: P11.29 ; also sheet 3
IBUS9: P11.30 ; also sheet 3
IBUS10: P11.31 ; also sheet 3
IBUS11: P11.32 ; also sheet 3
IBUS12: P11.33 ; also sheet 3
IBUS13: P11.34 ; also sheet 3
IBUS14: P11.35 ; also sheet 3
IBUS15: P11.36 ; also sheet 3
VCC [low power]: C61.1 C62.1 C63.+ C64.+ EXP.A3 EXP.A32 EXP.B3 EXP.B32 EXP.C3 EXP.C32 ; also sheet 2,3,4
Unconnected: EXP.B5 EXP.B21 EXP.B23

### Buses
IBUS[0..15]

### Notes on the sheet
- Control Bus (processor bus) | Expansion Bus (computer bus)
- @(3.95,3.35) | @(1.45, 3.35)
- (1) | (1) | (1)
- (3)
- (2) | (2)
- (3)
- (3)
- (5)
- PCB @ (0, 1.95) | (4)
- Notes
- (1) This pin is connected to a bus bar for power distribution, but the CFT does not (yet) require it.
- It's likely to be connected to another voltage level like +3.3V for easier interfacing. Reserved for now.
- (2) Pins *TPA and *TPC are not bussed. They are locally connected to each card's corresponding
- test pins (A17 & C17) to serve as test points.
- (3) Reserved for future expansion
- (4) Cheaper, 64-pin A+C row DIN41662 Type C plugs may be used for most expansion cards.
- (5) !IRQ! is provided for systems which lack an interrupt controller (!IRQ0-7!)
- @(0.15, 3.675) | @(5.775, 3.675)
- J
- @(0.15, 0.25) | @(5.775, 0.25)

## Power pins joined to a net without a drawn wire
GND: IC1.8(GND) IC2.8(GND) IC3.7(P:GND) IC12.8(GND) IC13.8(GND) IC14.8(GND) IC15.8(GND) IC26.8(GND) IC27.8(GND) IC28.8(GND) IC29.8(GND) IC30.8(GND) IC31.8(GND) IC34.8(GND) IC44.8(GND) IC46.7(P:GND)
VCC: IC1.16(VCC) IC2.16(VCC) IC3.14(P:VCC) IC12.16(VCC) IC13.16(VCC) IC14.16(VCC) IC15.16(VCC) IC26.16(VCC) IC27.16(VCC) IC28.16(VCC) IC29.16(VCC) IC30.16(VCC) IC31.16(VCC) IC34.16(VCC) IC44.16(VCC) IC46.14(P:VCC)

## Library data of the parts
$4_37_$ = alexios:SIGNATURE: Soup signature
$4_39_$ = SparkFun:OSHW-LOGO: Open Source Hardware Logo This logo indicates the piece of hardware it is found on incorporates a OSHW license and/or adheres to the definition of open source hardware found here: http://freedomdefined.org/OSHW
$4_40_$ = alexios:QRCODE-*: Various QR codes in silkscreen.
C9-C11 C18 C19 C31-C42 C57-C59 C61 C62 = rcl:C-EU: CAPACITOR, European symbol
C63 C64 = rcl:CPOL-EU: POLARIZED CAPACITOR, European symbol
D1-D4 D17-D20 = alexios:1N4148: DIODE high speed (Philips)
EXP = alexios-19inch:VG96-3: PCB EUROCARD, 96-pin type C/ABC, 2.54 mm
IC1 = alexios:74*251: 1 of 8 data SELECTOR/MULTIPLEXER, 3-state
IC2 IC26-IC31 IC34 = alexios:74*595: 8-bit SHIFT REGISTER, output latch
IC3 = 74xx-eu:74*125: Quad bus BUFFER, 3-state
IC12-IC15 = alexios:74*165: 8-bit parallel load SHIFT REGISTER
IC44 = alexios:74*259: 8-bit addressable LATCH
IC46 = alexios:74*04: Hex INVERTER
JP1 = jumper:JP2E: JUMPER
P10 P11 X4 = con-3m:2540-: 3M (TM) Pak 100 4-Wall Header Source: 3M; OC_FARNELL: 9838414; OC_NEWARK: unknown
R1-R11 = resistor:R-EU_: RESISTOR, European symbol
RN2 RN4 RN5 RN7 RN8 RN11 RN12 RN15 = resistor-sil:G08R: SIL RESISTOR; OC_FARNELL: unknown; OC_NEWARK: unknown
U1-U4 = alexios:HOLE: Hole for a standoff or mount. Hole diameter: 3.3mm. External Diameter: 6mm. Suitable for M3 standoffs.

## Net classes
0 default: width 0.305 mm, clearance 0.203 mm
1 low power: width 1.27 mm, clearance 0.254 mm
2 Power Rail: width 0.61 mm, clearance 0.152 mm